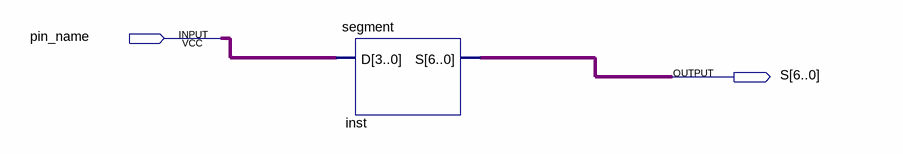
[diagram p0: schematic sheet]
// Quartus schematic Block1.bdf as structural Verilog: 1 symbols, 2 pins
module Block1 (
  input  pin_name,
  output [6:0] S
);

  wire [3:0] undriven;

  segment inst (.D(undriven), .S(S));
endmodule
